# EAGLE design Actuator-MKI-3 (EAGLE 9.6.2)

## Sheet 1 of 2: Part Schematics
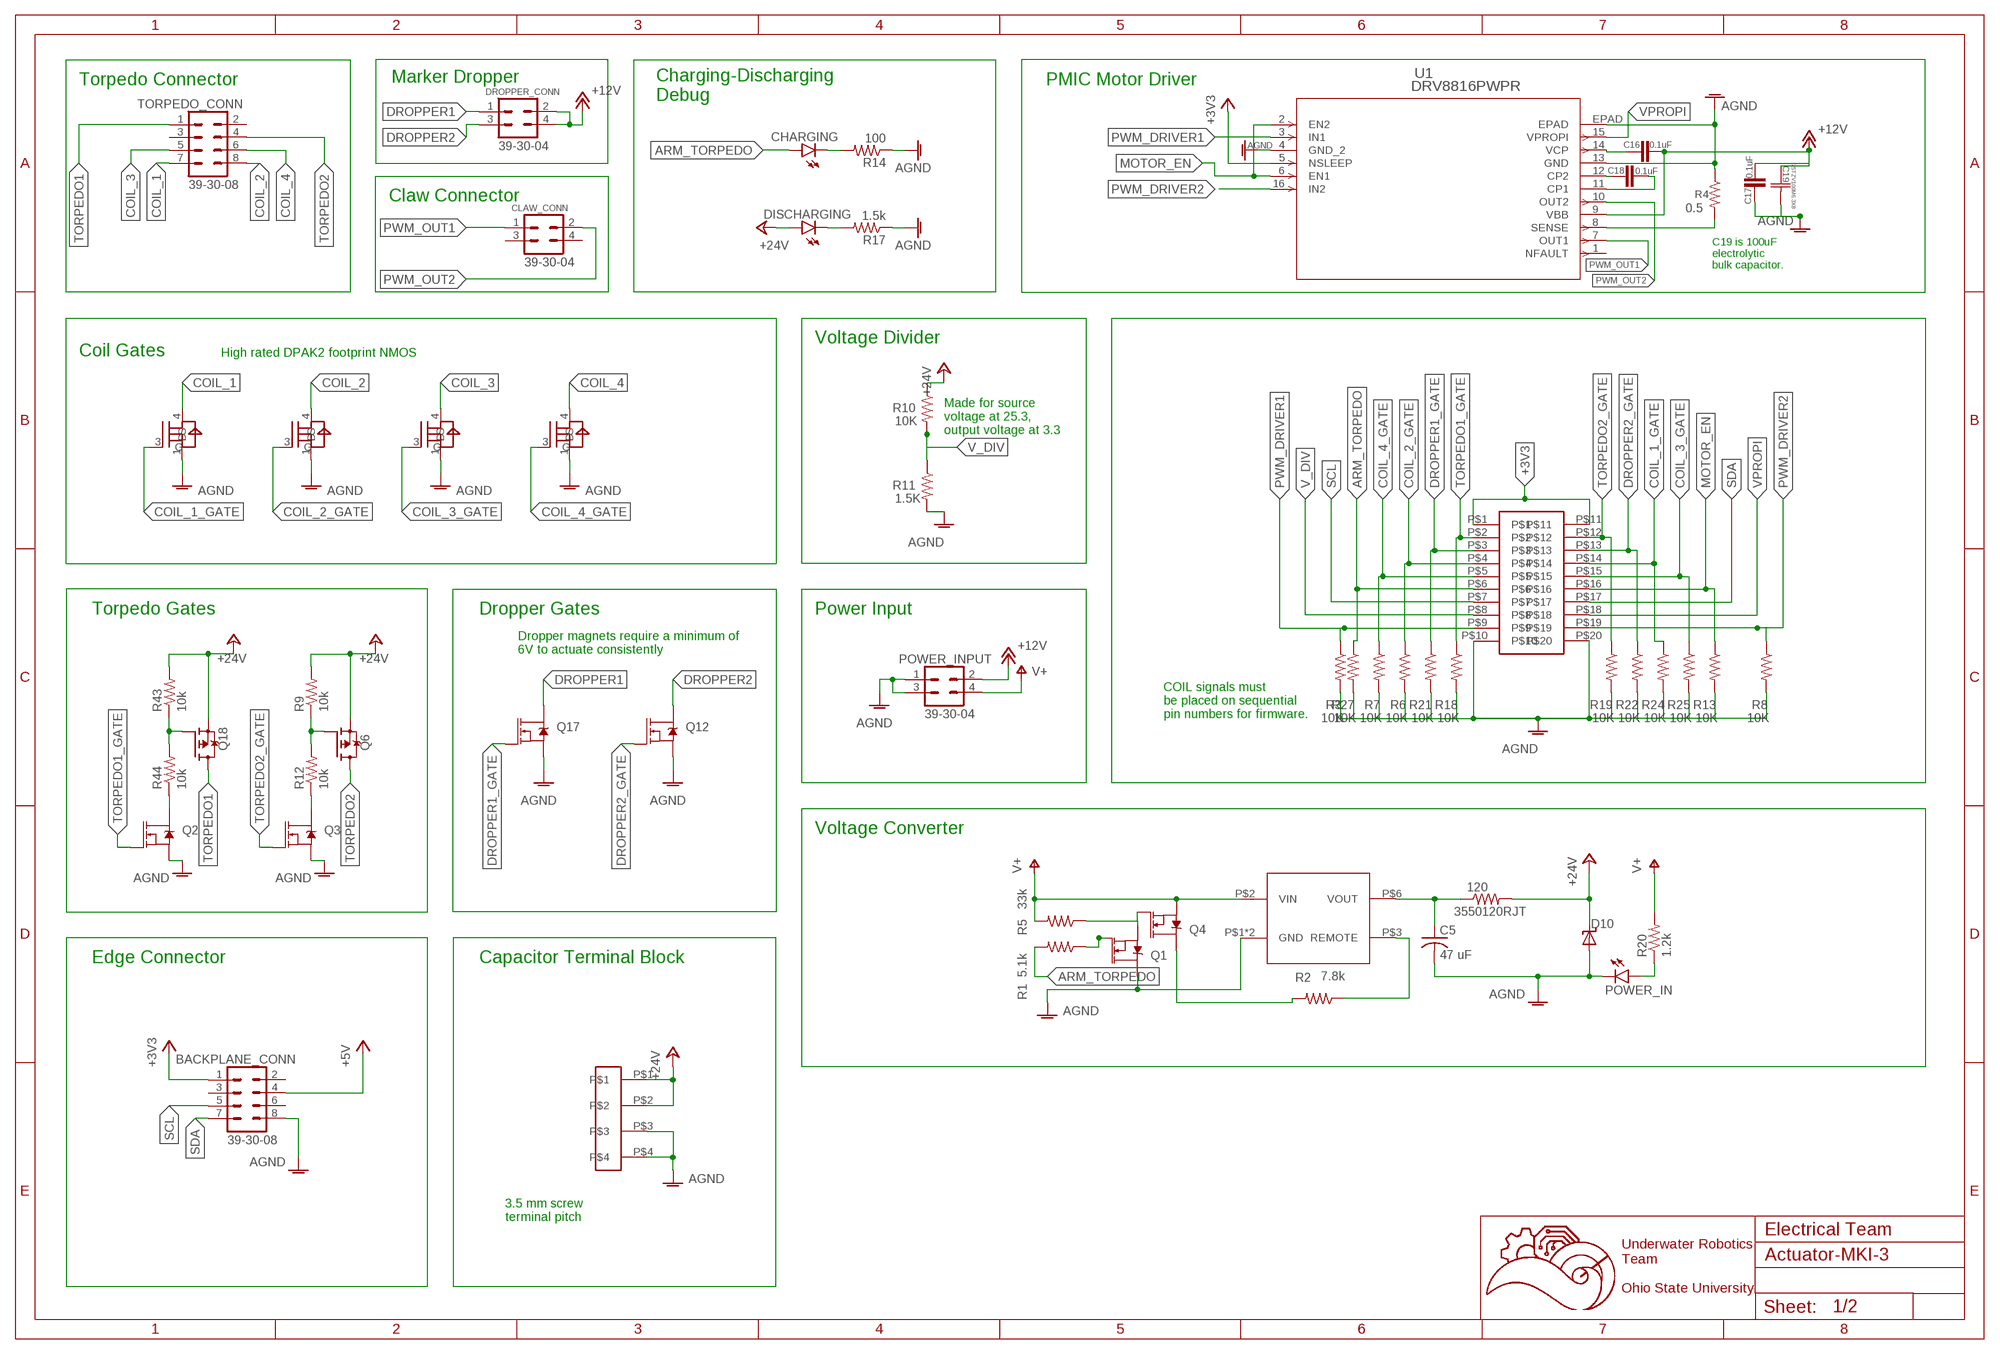
[diagram p0: schematic, sheet 1]

### Parts
120  3550120RJT  [3550120RJT]
BACKPLANE_CONN  39-30-08  [39-30-?08?]
C5  47 uF  C-USC1206K  [C1206K]
C16  0.1uF  C-EUC0603  [C0603]
C17  0.1uF  C-EUC0603  [C0603]
C18  0.1uF  C-EUC0603  [C0603]
C19  25TZV100M6.3X8  [CAP_J-V_6P3X8_RUB]
CHARGING  LEDCHIPLED_0603  [CHIPLED_0603]
CLAW_CONN  39-30-04  [39-30-?04?]
D10  SUPPRESSOR-SMBJ  [SMBJ]
DISCHARGING  LEDCHIPLED_0603  [CHIPLED_0603]
DROPPER_CONN  39-30-04  [39-30-?04?]
POWER_IN  LEDCHIPLED_0603  [CHIPLED_0603]
POWER_INPUT  39-30-04  [39-30-?04?]
Q1  MOSFET-NCH-AO3404A  [SOT23-3]
Q2  MOSFET-NCH-AO3404A  [SOT23-3]
Q3  MOSFET-NCH-AO3404A  [SOT23-3]
Q4  MOSFET-NCH-AO3404A  [SOT23-3]
Q6  FDD4141TO252  [TO252]
Q12  MOSFET-NCH-AO3404A  [SOT23-3]
Q17  MOSFET-NCH-AO3404A  [SOT23-3]
Q18  FDD4141TO252  [TO252]
R1  5.1k  R-US_R0603  [R0603]
R2  7.8k  R-US_R0603  [R0603]
R3  10K  R-US_R0603  [R0603]
R4  0.5  R-US_R0805  [R0805]
R5  33k  R-US_R0603  [R0603]
R6  10K  R-US_R0603  [R0603]
R7  10K  R-US_R0603  [R0603]
R8  10K  R-US_R0603  [R0603]
R9  10k  R-US_R0603  [R0603]
R10  10K  R-US_R0603  [R0603]
R11  1.5K  R-US_R0603  [R0603]
R12  10k  R-US_R0603  [R0603]
R13  10K  R-US_R0603  [R0603]
R14  100  R-US_R0805  [R0805]
R17  1.5k  R-US_R0805  [R0805]
R18  10K  R-US_R0603  [R0603]
R19  10K  R-US_R0603  [R0603]
R20  1.2k  R-US_R0805  [R0805]
R21  10K  R-US_R0603  [R0603]
R22  10K  R-US_R0603  [R0603]
R24  10K  R-US_R0603  [R0603]
R25  10K  R-US_R0603  [R0603]
R27  10K  R-US_R0603  [R0603]
R43  10k  R-US_R0603  [R0603]
R44  10k  R-US_R0603  [R0603]
TORPEDO_CONN  39-30-08  [39-30-?08?]
U1  DRV8816PWPR  [PWP_16]
U2  MBRB2060CTT4G  [D2PAK3-4_9P65X10P29_ONS]
U3  MBRB2060CTT4G  [D2PAK3-4_9P65X10P29_ONS]
U4  MBRB2060CTT4G  [D2PAK3-4_9P65X10P29_ONS]
U5  MBRB2060CTT4G  [D2PAK3-4_9P65X10P29_ONS]
U$1  31059104  [31059104]
U$2  JTAG-SMD  [JTAG-SMD]
U$6  TMR6-2415  [TMR6-2415]

### Nets
+3V3: BACKPLANE_CONN.1 U1.5(NSLEEP) U$2.P$1 U$2.P$11
+5V: BACKPLANE_CONN.4
+12V: C16.2 C17.2 C19.1 DROPPER_CONN.2 DROPPER_CONN.4 POWER_INPUT.2 U1.9(VBB)
+24V: 120.P$2 D10.C DISCHARGING.A Q6.2(S) Q18.2(S) R9.2 R10.1 R43.2 U$1.P$1 U$1.P$2
AGND: BACKPLANE_CONN.8 C5.2 C17.1 C19.2 D10.A POWER_IN.C POWER_INPUT.1 POWER_INPUT.3 Q1.3(D) Q2.2(S) Q3.2(S) Q12.2(S) Q17.2(S) R3.2 R4.1 R6.2 R7.2 R8.2 R11.2 R13.2 R14.1 R17.1 R18.2 R19.2 R21.2 R22.2 R24.2 R25.2 R27.2 U1.4(GND_2) U1.13(GND) U1.EPAD U2.1(S) U3.1(S) U4.1(S) U5.1(S) U$1.P$3 U$1.P$4 U$2.P$10 U$2.P$20 U$6.P$1(GND) U$6.P$7(GND)
ARM_TORPEDO: CHARGING.A R1.2 R27.1 U$2.P$6
COIL_1: TORPEDO_CONN.7 U2.4(D)
COIL_1_GATE: R24.1 U2.3(G) U$2.P$14
COIL_2: TORPEDO_CONN.8 U3.4(D)
COIL_2_GATE: R6.1 U3.3(G) U$2.P$4
COIL_3: TORPEDO_CONN.5 U4.4(D)
COIL_3_GATE: R25.1 U4.3(G) U$2.P$15
COIL_4: TORPEDO_CONN.6 U5.4(D)
COIL_4_GATE: R7.1 U5.3(G) U$2.P$5
DROPPER1: DROPPER_CONN.1 Q17.3(D)
DROPPER1_GATE: Q17.1(G) R21.1 U$2.P$3
DROPPER2: DROPPER_CONN.3 Q12.3(D)
DROPPER2_GATE: Q12.1(G) R22.1 U$2.P$13
MOTOR_EN: R13.1 U1.2(EN2) U1.6(EN1) U$2.P$16
N$2: C16.1 U1.14(VCP)
N$3: R2.1 U$6.P$3(REMOTE)
N$4: CHARGING.C R14.2
N$5: Q1.1(G) R1.1
N$6: Q1.2(S) Q4.1(G) R5.1
N$7: Q4.3(D) R2.2
N$10: POWER_IN.A R20.1
N$15: DISCHARGING.C R17.2
N$26: 120.P$1 C5.1 U$6.P$6(VOUT)
N$33: Q18.1(G) R43.1 R44.2
N$34: Q2.3(D) R44.1
N$35: Q6.1(G) R9.1 R12.2
N$36: Q3.3(D) R12.1
N$45: R4.2 U1.8(SENSE)
N$48: C18.2 U1.11(CP1)
N$49: C18.1 U1.12(CP2)
PWM_DRIVER1: R3.1 U1.3(IN1) U$2.P$9
PWM_DRIVER2: R8.1 U1.16(IN2) U$2.P$19
PWM_OUT1: CLAW_CONN.1 U1.7(OUT1)
PWM_OUT2: CLAW_CONN.2 U1.10(OUT2)
SCL: BACKPLANE_CONN.5 U$2.P$7
SDA: BACKPLANE_CONN.7 U$2.P$17
TORPEDO1: Q18.3(D) TORPEDO_CONN.1
TORPEDO1_GATE: Q2.1(G) R18.1 U$2.P$2
TORPEDO2: Q6.3(D) TORPEDO_CONN.4
TORPEDO2_GATE: Q3.1(G) R19.1 U$2.P$12
V+: POWER_INPUT.4 Q4.2(S) R5.2 R20.2 U$6.P$2(VIN)
V_DIV: R10.2 R11.1 U$2.P$8
VPROPI: U1.15(VPROPI) U$2.P$18
Unconnected: BACKPLANE_CONN.2 BACKPLANE_CONN.3 BACKPLANE_CONN.6 CLAW_CONN.3 CLAW_CONN.4 TORPEDO_CONN.2 TORPEDO_CONN.3 U1.1(NFAULT)

### Notes on the sheet
- Torpedo Connector | Marker Dropper | PMIC Motor Driver
- Charging-Discharging 
  Debug
- Claw Connector
- C19 is 100uF
  electrolytic
  bulk capacitor.
- Voltage Divider
- Coil Gates | High rated DPAK2 footprint NMOS
- Made for source 
  voltage at 25.3, 
  output voltage at 3.3
- Torpedo Gates | Dropper Gates | Power Input
- Dropper magnets require a minimum of 
  6V to actuate consistently
- COIL signals must
  be placed on sequential
  pin numbers for firmware.
- Voltage Converter
- Edge Connector | Capacitor Terminal Block
- 3.5 mm screw 
  terminal pitch
- Electrical Team
- Underwater Robotics
  Team
  
  Ohio State University

## Sheet 2 of 2: Notes
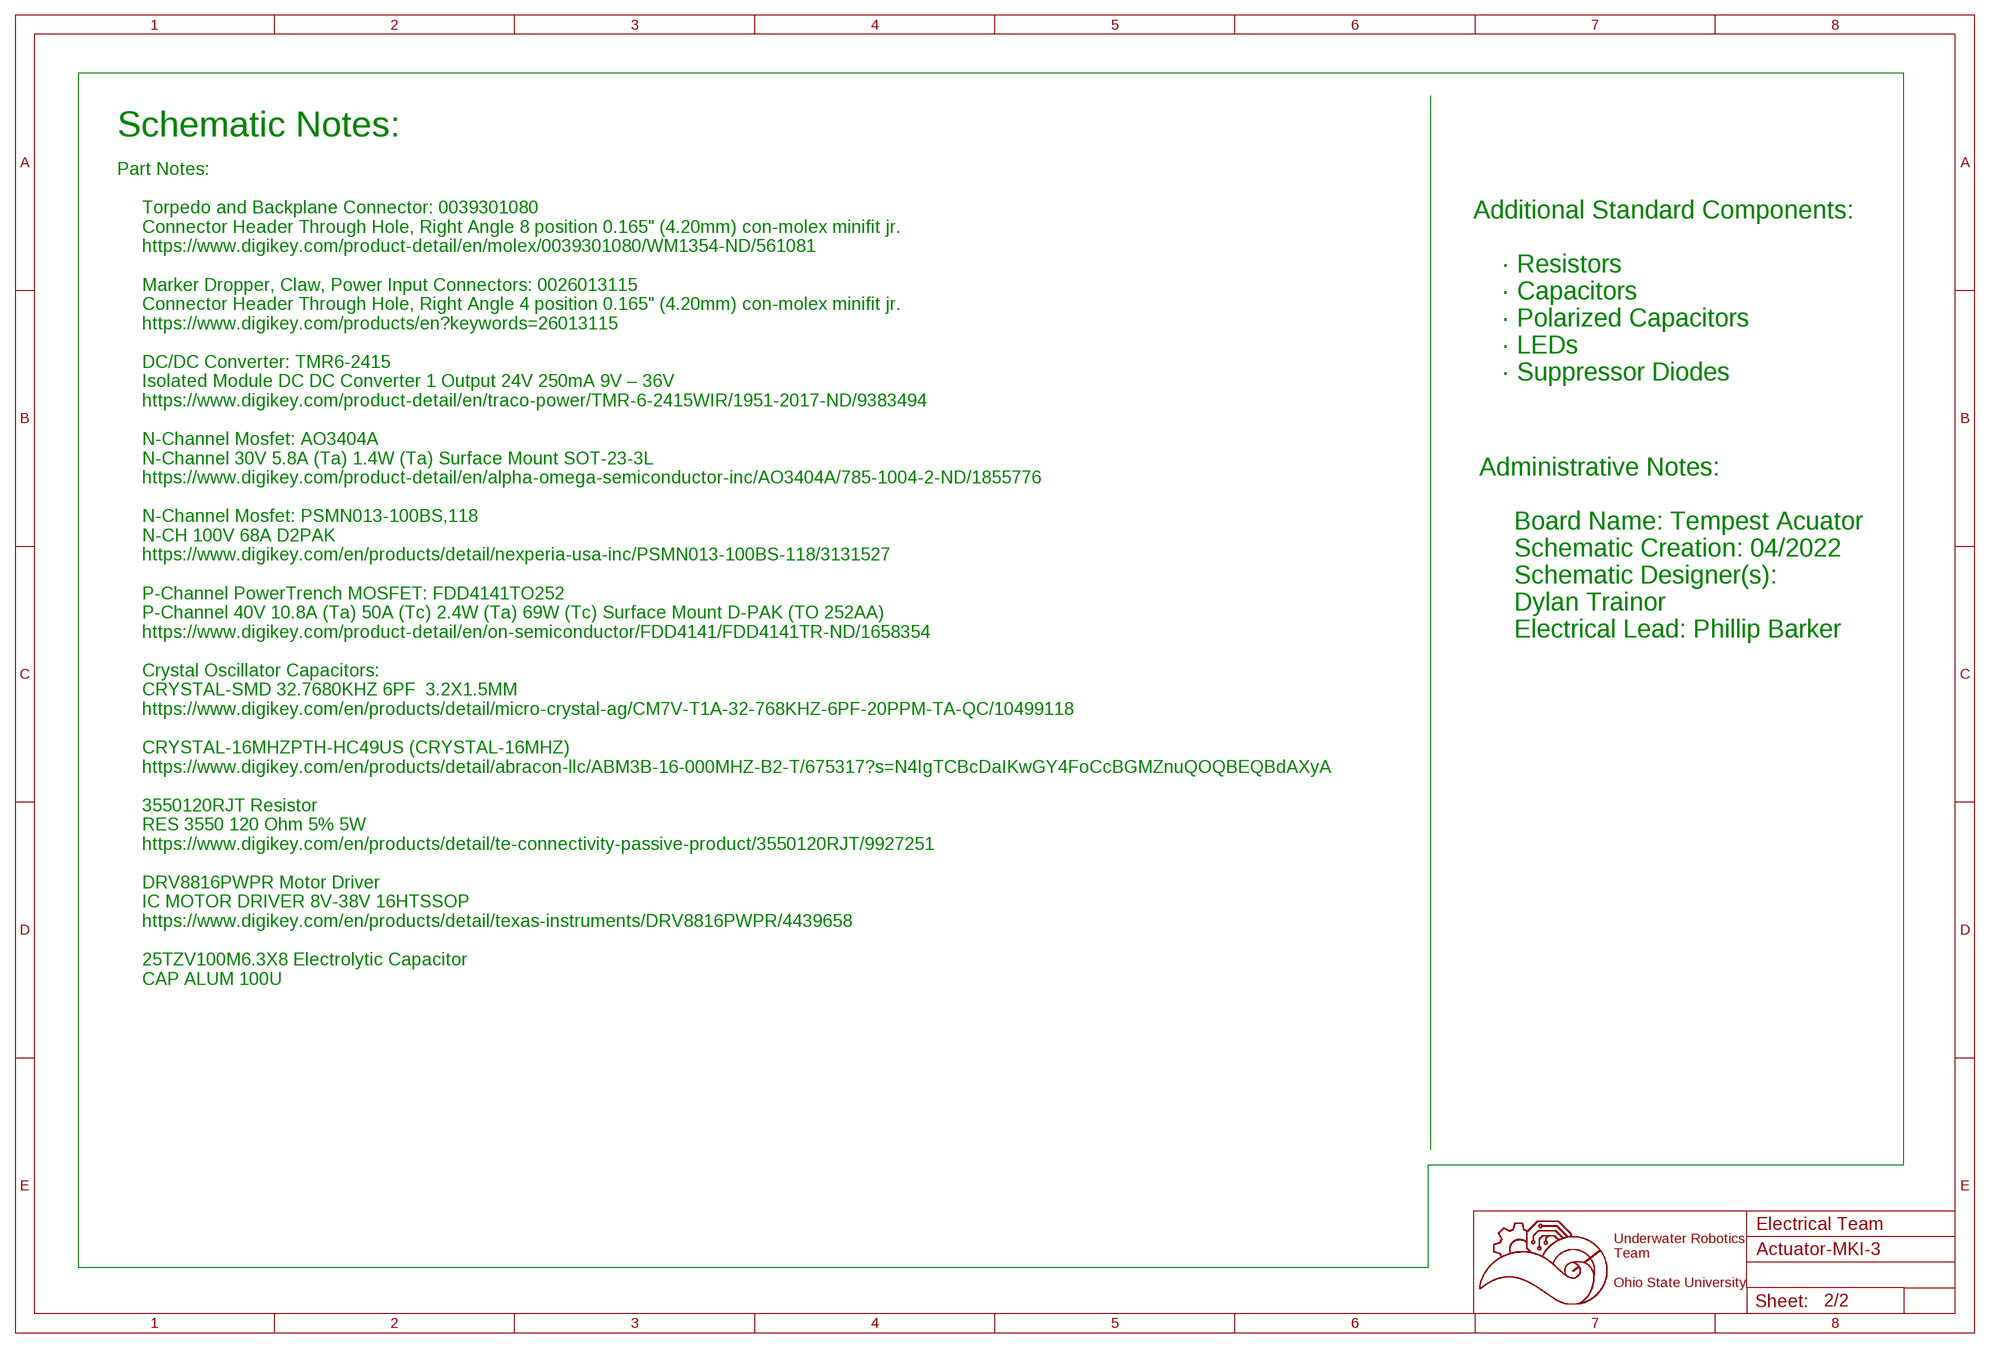
[diagram p1: schematic, sheet 2]

### Notes on the sheet
- Schematic Notes:
- Part Notes:
  
       Torpedo and Backplane Connector: 0039301080 
       Connector Header Through Hole, Right Angle 8 position 0.165" (4.20mm) con-molex minifit jr. 
       https://www.digikey.com/product-detail/en/molex/0039301080/WM1354-ND/561081 
    
       Marker Dropper, Claw, Power Input Connectors: 0026013115 
       Connector Header Through Hole, Right Angle 4 position 0.165" (4.20mm) con-molex minifit jr. 
       https://www.digikey.com/products/en?keywords=26013115 
    
       DC/DC Converter: TMR6-2415 
       Isolated Module DC DC Converter 1 Output 24V 250mA 9V – 36V 
       https://www.digikey.com/product-detail/en/traco-power/TMR-6-2415WIR/1951-2017-ND/9383494 
    
       N-Channel Mosfet: AO3404A 
       N-Channel 30V 5.8A (Ta) 1.4W (Ta) Surface Mount SOT-23-3L 
       https://www.digikey.com/product-detail/en/alpha-omega-semiconductor-inc/AO3404A/785-1004-2-ND/1855776 
    
       N-Channel Mosfet: PSMN013-100BS,118
       N-CH 100V 68A D2PAK
       https://www.digikey.com/en/products/detail/nexperia-usa-inc/PSMN013-100BS-118/3131527
  
       P-Channel PowerTrench MOSFET: FDD4141TO252 
       P-Channel 40V 10.8A (Ta) 50A (Tc) 2.4W (Ta) 69W (Tc) Surface Mount D-PAK (TO 252AA) 
       https://www.digikey.com/product-detail/en/on-semiconductor/FDD4141/FDD4141TR-ND/1658354
  
       Crystal Oscillator Capacitors: 
       CRYSTAL-SMD 32.7680KHZ 6PF  3.2X1.5MM 
       https://www.digikey.com/en/products/detail/micro-crystal-ag/CM7V-T1A-32-768KHZ-6PF-20PPM-TA-QC/10499118
  
       CRYSTAL-16MHZPTH-HC49US (CRYSTAL-16MHZ)
       https://www.digikey.com/en/products/detail/abracon-llc/ABM3B-16-000MHZ-B2-T/675317?s=N4IgTCBcDaIKwGY4FoCcBGMZnuQOQBEQBdAXyA 
  
       3550120RJT Resistor
       RES 3550 120 Ohm 5% 5W
       https://www.digikey.com/en/products/detail/te-connectivity-passive-product/3550120RJT/9927251
  
       DRV8816PWPR Motor Driver
       IC MOTOR DRIVER 8V-38V 16HTSSOP
       https://www.digikey.com/en/products/detail/texas-instruments/DRV8816PWPR/4439658
  
       25TZV100M6.3X8 Electrolytic Capacitor
       CAP ALUM 100UF 20% 25V SMD
       https://www.digikey.com/en/products/detail/rubycon/25TZV100M6-3X8/3134865
  
       UVK1E223MRD 22mF Capacitor
       CAP ALUM 22000UF 20% 25V RADIAL
       https://www.digikey.com/en/products/detail/nichicon/UVK1E223MRD/2539394
  
       1776112-4 Block Terminal
       TERM BLK 4POS SIDE ENT 3.5MM PCB
       https://www.digikey.com/en/products/detail/te-connectivity-amp-connectors/1776112-4/1826838
- Additional Standard Components:
  
       · Resistors 
       · Capacitors 
       · Polarized Capacitors 
       · LEDs 
       · Suppressor Diodes
- Administrative Notes:
  
       Board Name: Tempest Acuator
       Schematic Creation: 04/2022
       Schematic Designer(s): 
       Dylan Trainor
       Electrical Lead: Phillip Barker
- Electrical Team
- Underwater Robotics
  Team
  
  Ohio State University

## Library data of the parts
120 = 3550120RJT:3550120RJT
BACKPLANE_CONN TORPEDO_CONN = con-molex-mini-fit:39-30-?08?: HEADER
C5 = resistor:C-US: CAPACITOR, American symbol
C16-C18 = rcl:C-EU: CAPACITOR, European symbol; SPICEPREFIX: C
C19 = 25TZV100M6_3X8:25TZV100M6.3X8; BUILT_BY: EMA_Cory; COPYRIGHT: Copyright (C) 2018 Accelerated Designs. All rights reserved; MANUFACTURER_PART_NUMBER: 25TZV100M6.3X8; SOURCELIBRARY: Rubycon_2019-09-19; VENDOR: Rubycon Netherlands
CHARGING DISCHARGING POWER_IN = led:LED: LED OSRAM: - CHIPLED LG R971, LG N971, LY N971, LG Q971, LY Q971, LO R971, LY R971 LH N974, LH R974 LS Q976, LO Q976, LY Q976 LO Q996 - Hyper CHIPLED LW Q18S LB Q993, LB Q99A, LB R99A - SideLED LS A670, LO A670, LY A670, LG A670, LP A670 LB A673, LV A673, LT A673, LW A673 LH A674 LY A675 LS A676, LA A676, LO A676, LY A676, LW A676 LS A679, LY A679, LG A679 - Hyper Micro SIDELED® LS Y876, LA Y876, LO Y876, LY Y876 LT Y87S - SmartLED LW L88C, LW L88S LB L89C, LB L89S, LG L890 LS L89K, LO L89K, LY L89K LS L896, LA L896, LO L896, LY L896 - TOPLED LS T670, LO T670, LY T670, LG T670, LP T670 LSG T670, LSP T670, LSY T670, LOP T670, LYG T670 LG T671, LOG T671, LSG T671 LB T673, LV T673, LT T673, LW T673 LH T674 LS T676, LA T676, LO T676, LY T676, LB T676, LH T676, LSB T676, LW T676 LB T67C, LV T67C, LT T67C, LS T67K, LO T67K, LY T67K, LW E67C LS E67B, LA E67B, LO E67B, LY E67B, LB E67C, LV E67C, LT E67C LW T67C LS T679, LY T679, LG T679 LS T770, LO T770, LY T770, LG T770, LP T770 LB T773, LV T773, LT T773, LW T773 LH T774 LS E675, LA E675, LY E675, LS T675 LS T776, LA T776, LO T776, LY T776, LB T776 LHGB T686 LT T68C, LB T68C - Hyper Mini TOPLED® LB M676 - Mini TOPLED Santana® LG M470 LS M47K, LO M47K, LY M47K Source: http://www.osram.convergy.de LUXEON: - LUMILED® LXK2-PW12-R00, LXK2-PW12-S00, LXK2-PW14-U00, LXK2-PW14-V00 LXK2-PM12-R00, LXK2-PM12-S00, LXK2-PM14-U00 LXK2-PE12-Q00, LXK2-PE12-R00, LXK2-PE12-S00, LXK2-PE14-T00, LXK2-PE14-U00 LXK2-PB12-K00, LXK2-PB12-L00, LXK2-PB12-M00, LXK2-PB14-N00, LXK2-PB14-P00, LXK2-PB14-Q00 LXK2-PR12-L00, LXK2-PR12-M00, LXK2-PR14-Q00, LXK2-PR14-R00 LXK2-PD12-Q00, LXK2-PD12-R00, LXK2-PD12-S00 LXK2-PH12-R00, LXK2-PH12-S00 LXK2-PL12-P00, LXK2-PL12-Q00, LXK2-PL12-R00 Source: www.luxeon.com KINGBRIGHT: KA-3528ASYC Source: www.kingbright.com
CLAW_CONN DROPPER_CONN POWER_INPUT = con-molex-mini-fit:39-30-?04?: HEADER
D10 = diode:SUPPRESSOR-: Suppressor diode
Q1-Q4 Q12 Q17 = SparkFun-DiscreteSemi:MOSFET-NCH: N-channel MOSFETs Voltage controlled devices that allow control of high current outputs. SparkFun Products: SparkFun OpenScale <https://www.sparkfun.com/products/13261> SparkFun Digital Sandbox <https://www.sparkfun.com/products/12651> SparkFun Monster Moto Shield <https://www.sparkfun.com/products/10182> SparkFun MOSFET Power Controller <https://www.sparkfun.com/products/11214>; PROD_ID: TRANS-12988; VALUE: 5.8A/30V/35mΩ
Q6 Q18 = transistor-fet:FDD4141: P-Channel PowerTrench® MOSFET Source: FDD4141.pdf
R1-R14 R17-R22 R24 R25 R27 R43 R44 = resistor:R-US_: RESISTOR, American symbol
U1 = DRV8816POWPR:DRV8816PWPR; MANUFACTURER_PART_NUMBER: DRV8816PWPR; VENDOR: Texas Instruments
U2-U5 = DPAK2:MBRB2060CTT4G
U$1 = 31059104:31059104
U$2 = JTAG-SMD:JTAG-SMD
U$6 = converter:TMR6-2415

## Board
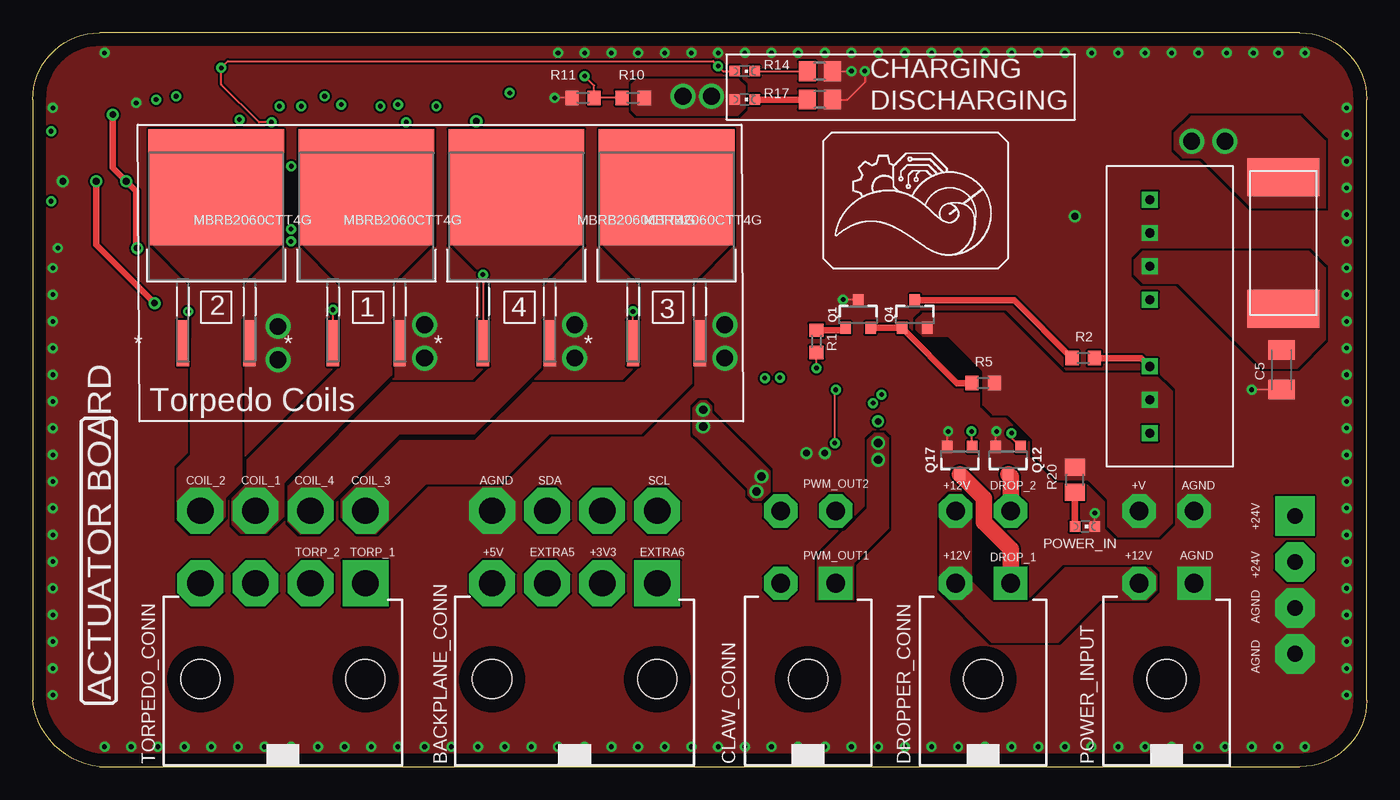
[diagram p2: board, top side]
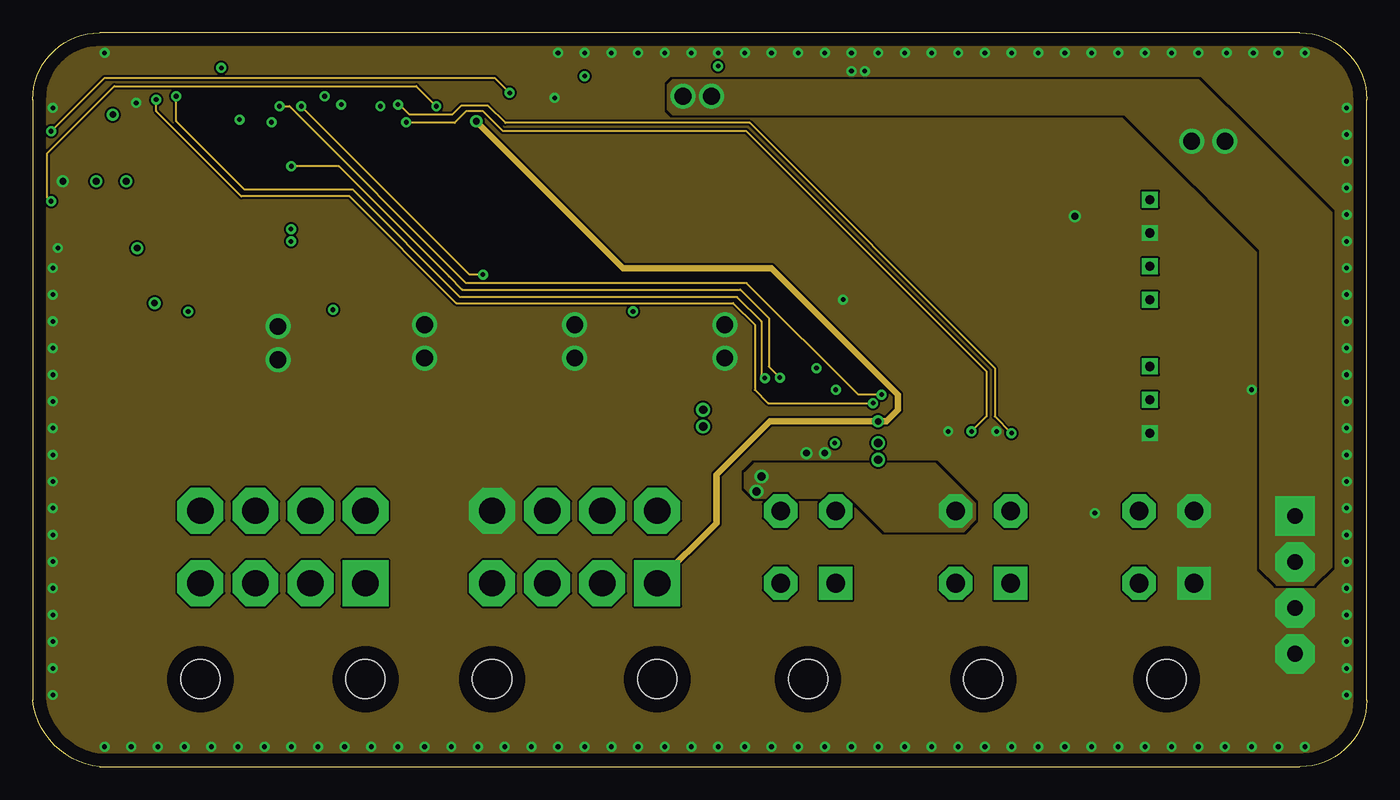
[diagram p3: board, inner layer Route2]
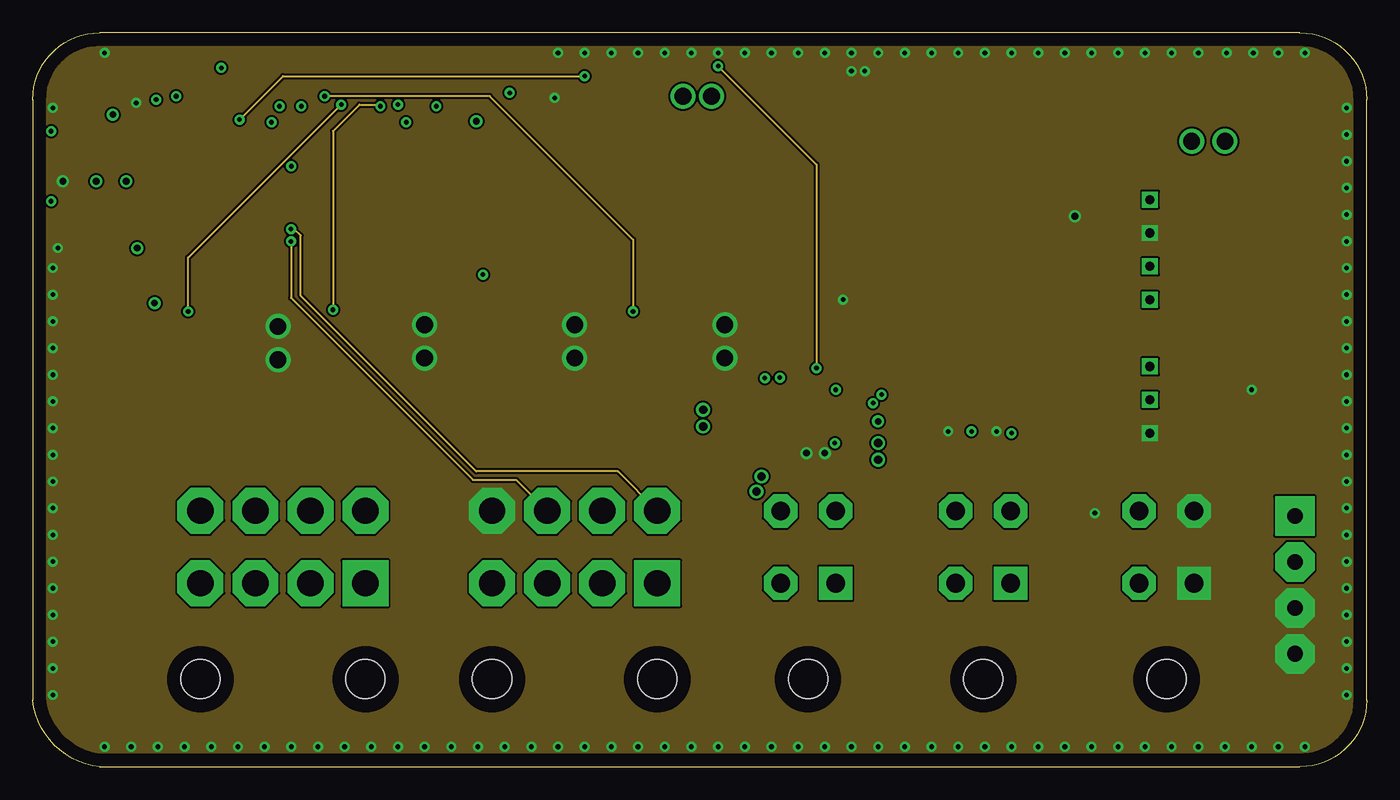
[diagram p4: board, inner layer Route15]
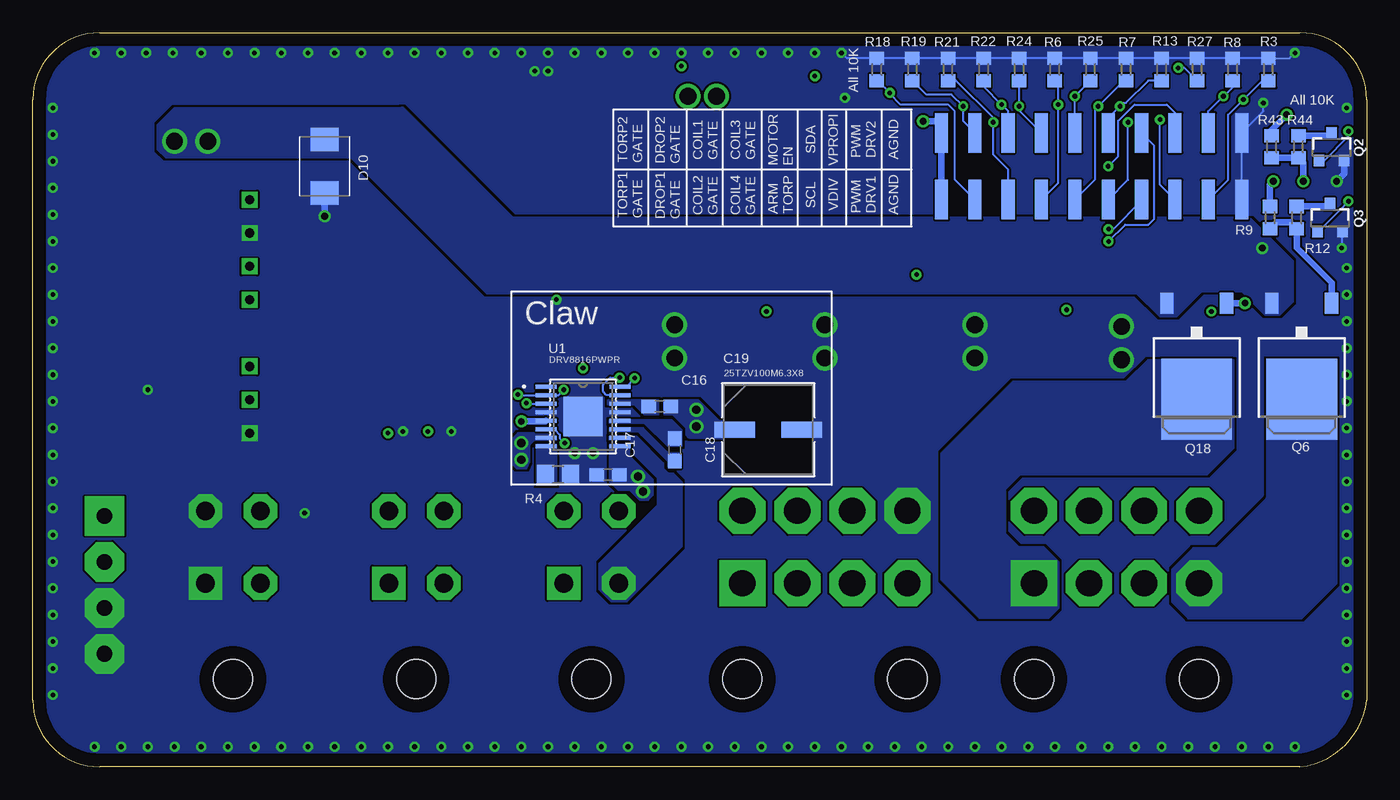
[diagram p5: board, bottom side, seen from below]

Size 101.6 x 55.88 mm. Coordinates in mm from the lower left corner, seen from the top.
Outline: 5.08,0 96.52,0 arc90 101.6,5.08 101.6,50.8 arc90 96.52,55.88 5.08,55.88 arc90 0,50.8 0,5.08 arc77 5.08,0
Copper layers (1+2*15+16): Top 0.035mm / dielectric 1.5mm / Route2 0.035mm / dielectric 0.15mm / Route15 0.035mm / dielectric 0.2mm / Bottom 0.035mm
Design rules "default *": minimum track width 6mil, minimum drill 0.35mm, track to track 6mil, track to pad 6mil, pad to pad 6mil, via to via 6mil, smd to smd 6mil, copper to edge 40mil, drill to drill 6mil, minimum pad ring 10mil, minimum via ring 8mil, stop-mask expansion 4mil, vias tented up to drill 0mil, thermal gap 10mil

### Footprints (pad centres in the part's own frame; a part is rotated, then mirrored left to right if it is on the bottom)
3550120RJT = smd 2.896 x 5.499: P$1 -5,0; P$2 5,0
39-30-?08? = drill 2 pad 3.5 square: 1 6.287,0 | drill 2 pad 3.5 octagon: 2 2.095,0; 3 -2.095,0; 4 -6.287,0; 5 6.287,5.512; 6 2.095,5.512; 7 -2.095,5.512; 8 -6.287,5.512 | hole 3: -6.287,-7.3; 6.287,-7.3
C1206K = smd 1.5 x 2: 1 -1.5,0; 2 1.5,0
C0603 = smd 1.1 x 1: 1 -0.85,0; 2 0.85,0
CAP_J-V_6P3X8_RUB = smd 3.099 x 1.219: 1 -2.553,0; 2 2.553,0
CHIPLED_0603 = smd 0.8 x 0.8: A 0,-0.75; C 0,0.75
39-30-?04? = drill 1.422 pad 2.54 square: 1 2.095,0 | drill 1.422 pad 2.54 octagon: 2 -2.095,0; 3 2.095,5.512; 4 -2.095,5.512 | hole 3: 0,-7.3
SMBJ = smd 1.78 x 2.16: A 2.04,0; C -2.03,0
SOT23-3 = smd 0.8 x 0.9: 1 -0.95,-1; 2 0.95,-1; 3 0,1.1
TO252 = smd 1 x 1.6: 1 -2.28,-4.8; 2 2.28,-4.8 | smd 5.4 x 6.2: 3 0,2.5
R0603 = smd 1 x 1.1: 1 -0.85,0; 2 0.85,0
R0805 = smd 1.3 x 1.5: 1 -0.95,0; 2 0.95,0
PWP_16 = smd 1.6 x 0.3: 1 -2.8,2.275; 2 -2.8,1.625; 3 -2.8,0.975; 4 -2.8,0.325; 5 -2.8,-0.325; 6 -2.8,-0.975; 7 -2.8,-1.625; 8 -2.8,-2.275; 9 2.8,-2.275; 10 2.8,-1.625; 11 2.8,-0.975; 12 2.8,-0.325; 13 2.8,0.325; 14 2.8,0.975; 15 2.8,1.625; 16 2.8,2.275 | smd 3 x 3: EPAD 0,0
D2PAK3-4_9P65X10P29_ONS = smd 0.94 x 3.505: 1 2.54,-9.652; 3 -2.54,-9.652 | smd 10.338 x 8.839: 4 0,2.21
31059104 = drill 1.2 pad 3 square: P$1 0,-5.25 | drill 1.2 pad 3 octagon: P$2 0,-1.75; P$3 0,1.75; P$4 0,5.25
JTAG-SMD = smd 3 x 1: P$1 -2.54,11.43; P$2 -2.54,8.89; P$3 -2.54,6.35; P$4 -2.54,3.81; P$5 -2.54,1.27; P$6 -2.54,-1.27; P$7 -2.54,-3.81; P$8 -2.54,-6.35; P$9 -2.54,-8.89; P$10 -2.54,-11.43; P$11 2.54,11.43; P$12 2.54,8.89; P$13 2.54,6.35; P$14 2.54,3.81; P$15 2.54,1.27; P$16 2.54,-1.27; P$17 2.54,-3.81; P$18 2.54,-6.35; P$19 2.54,-8.89; P$20 2.54,-11.43
TMR6-2415 = drill 0.7 square: P$1 0,0; P$2 2.54,0; P$3 5.08,0; P$5 10.16,0; P$6 12.7,0; P$7 15.24,0; P$8 17.78,0

### Placement (x,y rotation side)
120  95.25,39.88 90 top
BACKPLANE_CONN  39-30-08?  [39-30-?08?]  41.27,13.97 0 top
C5  95.12,30.23 270 top
C16  53.85,27.43 0 bottom
C17  57.78,22.23 0 bottom
C18  52.7,24.13 270 bottom
C19  45.59,25.65 0 bottom
CHARGING  54.23,52.96 270 top
CLAW_CONN  39-30-04?  [39-30-?04?]  59.05,13.97 0 top
D10  79.38,45.72 270 bottom
DISCHARGING  54.23,50.8 270 top
DROPPER_CONN  39-30-04?  [39-30-?04?]  72.39,13.97 0 top
POWER_IN  80.14,18.29 270 top
POWER_INPUT  39-30-04?  [39-30-?04?]  86.36,13.97 0 top
Q1  62.87,34.42 0 top
Q2  2.67,47.16 0 bottom
Q3  2.79,41.76 0 bottom
Q4  67.18,34.42 0 top
Q6  4.95,30.48 180 bottom
Q12  74.3,23.37 180 top
Q17  70.61,23.37 180 top
Q18  12.95,30.48 180 bottom
R1  59.69,32.38 270 top
R2  80.01,31.11 180 top
R3  7.49,53.09 90 bottom
R4  61.59,22.23 180 bottom
R5  72.39,29.21 0 top
R6  23.76,53.09 90 bottom
R7  18.34,53.09 90 bottom
R8  10.2,53.09 90 bottom
R9  7.37,41.81 90 bottom
R10  45.72,50.93 180 top
R11  41.91,50.93 180 top
R12  5.33,41.81 270 bottom
R13  15.63,53.09 90 bottom
R14  59.94,52.96 180 top
R17  59.94,50.8 180 top
R18  37.31,53.09 90 bottom
R19  34.6,53.09 90 bottom
R20  79.38,21.84 90 top
R21  31.89,53.09 90 bottom
R22  29.18,53.09 90 bottom
R24  26.47,53.09 90 bottom
R25  21.05,53.09 90 bottom
R27  12.92,53.09 90 bottom
R43  7.24,47.21 90 bottom
R44  5.21,47.21 270 bottom
TORPEDO_CONN  39-30-08?  [39-30-?08?]  19.05,13.97 0 top
U1  59.69,26.67 0 bottom
U2  25.4,41.91 0 top
U3  13.97,41.91 0 top
U4  48.26,41.91 0 top
U5  36.83,41.91 0 top
U$1  96.14,13.84 180 top
U$2  20.95,45.72 90 bottom
U$6  85.09,25.4 90 top

### Tracks (layer width: path | path; a pad name or v marks a point on that pad's centre or on a via)
+3V3  (via drill 0.51)
  Route2 0.508: v33.78,49.15 44.96,37.97 56.26,37.97 65.91,28.32 65.91,27.18 65.02,26.29 v64.39,26.29 56.13,26.29 52.07,22.23 52.07,18.54 47.56,14.03 BACKPLANE_CONN.1
  Bottom 0.508: v64.39,26.29 62.55,26.29 U1.5 | v33.78,49.15 32.64,49.15 32.38,48.9 U$2.P$11 U$2.P$1
+12V  (via drill 0.64)
  other vias: 55.5,22.1 55.12,20.95 51.05,25.91 51.05,27.18
  pour Bottom (no thermals): 57.66,24.51 57.66,21.72 57.02,21.08 56.13,21.08 55.37,20.32 54.74,20.32 54.36,20.7 54.36,21.84 56.13,23.62 56.13,24.38 56.26,24.51
  pour Bottom (no thermals): 53.47,27.94 50.93,27.94 49.4,26.42 49.4,25.02 51.56,25.02 51.82,25.27 51.82,25.78 52.83,26.8 53.47,26.8
  pour Top (no thermals): 50.55,25.15 54.48,21.21 54.48,20.7 54.86,20.32 55.5,20.32 56.13,20.95 56.13,22.48 51.69,26.92 51.69,27.43 51.31,27.81 50.8,27.81 50.29,27.3 50.29,25.4
  pour Bottom (no thermals): 49.78,25.02 46.61,25.02 46.61,26.29 49.78,26.29
  pour Top (no thermals): 85.09,15.11 78.61,15.11 76.07,12.57 73.03,12.57 71.5,14.1 71.5,19.94 70.74,20.7 69.85,20.7 69.09,19.94 69.09,13.46 73.03,9.53 78.11,9.53 81.28,12.7 84.84,12.7 85.6,13.46 85.6,14.61
  pour Route2 (no thermals): 54.23,21.21 54.23,22.35 54.99,23.11 68.71,23.11 71.75,20.07 71.75,18.8 70.87,17.91 64.9,17.91 62.36,20.45 54.99,20.45
+24V  (via drill 0.51, 1.27)
  Top 0.508: v6.1,49.66 6.1,45.59 v7.11,44.58 7.89,43.8 7.89,39.5 7.93,39.46 v7.95,39.48
  Bottom 0.508: R43.2 7.24,48.51 v6.1,49.66 | R9.2 7.37,44.32 v7.11,44.58
  other vias: 88.27,47.62 90.81,47.62 49.53,51.05 51.69,51.05
  pour Top (no thermals): 92.84,42.55 89.03,46.35 87.63,46.35 87,46.99 87,48.26 88.27,49.53 96.52,49.53 98.42,47.62 98.42,42.55
  pour Bottom (no thermals): 92.08,48.9 90.81,50.16 73.41,50.16 77.22,46.35 91.44,46.35 92.08,46.99
  pour Bottom (no thermals): 77.34,46.35 67.06,36.07 17.53,36.07 15.75,34.29 14.48,34.29 12.57,36.2 9.53,36.2 7.75,34.42 6.6,34.42 5.59,35.43 5.59,38.48 8.89,41.78 65.02,41.78 73.41,50.16 73.53,50.16
  pour Top (no thermals): 54.23,50.16 54.23,51.82 53.72,52.32 45.97,52.32 45.59,51.94 45.59,50.04 45.97,49.66 53.72,49.66
  pour Route2 (no thermals): 48.39,51.94 48.77,52.32 88.77,52.32 92.2,48.9 92.2,45.59 90.93,44.32 88.52,44.32 83.19,49.66 48.77,49.66 48.39,50.04
  pour Route2 (no thermals): 85.6,47.24 93.47,39.37 93.47,15.11 94.74,13.84 97.54,13.84 98.93,15.24 98.93,42.16 90.93,50.16 87.12,50.16 85.6,48.64
AGND  (via drill 0.35, 0.35 pad 0.51, 0.51, 0.51 pad 0.51, 1.27)
  Top 0.152: Q17.2 69.66,25.47 v69.72,25.53 | Q12.2 73.34,25.47 v73.41,25.53 | POWER_IN.C 80.89,19.29 v80.9,19.3 | C5.2 95.1,28.7 v92.84,28.7 | R14.1 v62.36,52.96 | R17.1 62.04,50.8 63.37,52.14 v63.37,52.96 | R11.2 v39.75,50.93 | Q1.3 62.82,35.56 v61.72,35.56
  Bottom 0.152: v5.46,54.36 5.88,53.94 R3.2 R8.2 R27.2 R13.2 R7.2 R25.2 R6.2 R24.2 R22.2 R21.2 R19.2 R18.2 39.59,53.94 v40.01,54.36 | U$2.P$10 U$2.P$20 7.87,49.91 v7.87,50.55 | Q3.2 1.91,40.7 v1.91,39.5
  Bottom 0.508: Q2.2 1.72,45.15 v2.29,44.58 | D10.A v79.38,41.91
  other vias: 29.84,31.11 29.84,33.66 41.27,31.11 41.27,33.66 52.7,33.66 52.7,31.11 18.67,30.99 18.67,33.53 5.46,1.52 7.49,1.52 9.53,1.52 11.56,1.52 13.59,1.52 15.62,1.52 17.65,1.52 19.68,1.52 21.72,1.52 23.75,1.52 25.78,1.52 27.81,1.52 29.84,1.52 31.88,1.52 33.91,1.52 35.94,1.52 37.97,1.52 40.01,1.52 42.04,1.52 44.07,1.52 46.1,1.52 48.13,1.52 50.16,1.52 52.2,1.52 54.23,1.52 56.26,1.52 58.29,1.52 60.33,1.52 62.36,1.52 64.39,1.52 66.42,1.52 68.45,1.52 70.48,1.52 72.52,1.52 74.55,1.52 76.58,1.52 78.61,1.52 80.64,1.52 82.68,1.52 84.71,1.52 86.74,1.52 88.77,1.52 90.81,1.52 92.84,1.52 94.87,1.52 96.9,1.52 42.04,54.36 44.07,54.36 46.1,54.36 48.13,54.36 50.16,54.36 52.2,54.36 54.23,54.36 56.26,54.36 58.29,54.36 60.33,54.36 62.36,54.36 64.39,54.36 66.42,54.36 68.45,54.36 70.48,54.36 72.52,54.36 74.55,54.36 76.58,54.36 78.61,54.36 80.64,54.36 82.68,54.36 84.71,54.36 86.74,54.36 96.9,54.36 1.52,5.46 100.08,5.46 100.08,7.49 100.08,9.53 100.08,11.56 100.08,13.59 100.08,15.62 100.08,17.65 100.08,19.68 100.08,21.72 100.08,23.75 100.08,25.78 100.08,27.81 100.08,29.84 100.08,31.88 100.08,33.91 100.08,35.94 100.08,37.97 100.08,40.01 100.08,42.04 100.08,44.07 100.08,46.1 100.08,48.13 100.08,50.16 1.52,7.49 1.52,9.53 1.52,11.56 1.52,13.59 1.52,15.62 1.52,17.65 1.52,19.68 1.52,21.72 1.52,23.75 1.52,25.78 1.52,27.81 1.52,29.84 1.52,31.88 1.52,33.91 1.52,35.94 1.52,37.97 1.52,50.16 58.93,23.88 60.33,23.88 88.77,54.36 90.93,54.36 92.96,54.36 94.87,54.36
  pour Bottom (no thermals): 58.04,20.95 58.04,26.8 55.88,26.8 55.88,27.18 58.17,27.18 58.17,29.84 61.21,29.84 61.21,27.18 63.5,27.18 63.5,26.8 61.34,26.8 61.34,20.95
  pour Top (rank 6, no thermals): 0,0 101.6,0 101.6,55.88 0,55.88
  pour Route2 (rank 6, no thermals): 0,0 0,55.88 101.6,55.88 101.6,0
  pour Route15 (rank 6, no thermals): 0,0 0,55.88 101.6,55.88 101.6,0
  pour Bottom (rank 6, no thermals): 0,0 0,55.88 101.6,55.88 101.6,0
ARM_TORPEDO  (via drill 0.35)
  Top 0.152: v59.69,30.35 R1.2 | CHARGING.A 52.58,52.96 v52.2,53.34 51.82,53.72 14.86,53.72 v14.35,53.21 14.35,51.94 17.22,49.07 v18.18,49.07
  Route15 0.152: v52.2,53.34 59.69,45.85 v59.69,30.35
  Bottom 0.152: v14.35,53.21 13.89,53.21 R27.1 | U$2.P$6 18.18,44.69 v18.18,49.07
COIL_1
  pour Top (no thermals): 20.32,48.26 30.48,48.26 30.48,40.01 27.3,36.83 27.3,29.84 19.05,21.59 19.05,19.05 17.78,17.78 15.88,17.78 15.24,18.41 15.24,20.45 16.38,21.59 16.38,23.37 23.5,30.48 23.5,36.83 20.32,40.01
COIL_1_GATE  (via drill 0.35)
  Top 0.152: U2.3 v22.86,34.8
  Route15 0.152: v22.86,34.8 22.86,48.39 24.89,50.42 26.34,50.42 v26.47,50.29
  Bottom 0.152: U$2.P$14 26.47,49.97 v26.47,50.29 R24.1
COIL_2
  pour Top (no thermals): 12.06,17.78 11.05,18.8 11.05,22.73 12.06,23.75 12.06,36.83 8.89,40.01 8.89,48.26 19.05,48.26 19.05,40.01 15.88,36.83 15.88,21.72 14.61,20.45 14.61,19.05 13.34,17.78
COIL_2_GATE  (via drill 0.35)
  Top 0.152: v11.83,34.66 11.83,32.66 U3.3
  Route15 0.152: v11.83,34.66 11.83,38.76 v23.5,50.42
  Bottom 0.152: U$2.P$4 23.5,44.45 v23.5,50.42 23.5,51.97 R6.1
COIL_3
  pour Top (no thermals): 43.18,48.26 43.18,40.01 46.35,36.83 46.35,30.48 45.09,29.21 38.1,29.21 33.66,24.77 27.94,24.77 23.5,20.32 23.5,19.05 24.77,17.78 26.16,17.78 29.97,21.59 35.56,21.59 39.37,25.4 46.35,25.4 50.16,29.21 50.16,36.83 53.34,40.01 53.34,48.26
COIL_3_GATE  (via drill 0.35)
  Top 0.152: U4.3 v45.72,34.67
  Route15 0.152: v45.72,34.67 45.72,40.13 34.8,51.05 v22.23,51.05 22.22,51.05
  Bottom 0.152: U$2.P$15 v22.23,51.05 R25.1
COIL_4
  pour Top (no thermals): 31.75,48.26 31.75,40.01 34.92,36.83 34.92,30.48 33.66,29.21 27.3,29.21 19.43,21.34 19.43,18.67 20.32,17.78 21.72,17.78 22.86,18.92 22.86,20.32 27.94,25.4 33.66,25.4 38.73,30.48 38.73,36.83 41.91,40.01 41.91,48.26
COIL_4_GATE  (via drill 0.35)
  Top 0.152: v34.29,37.47 U5.3
  Route2 0.152: v34.29,37.47 33.27,37.47 v20.45,50.29
  Bottom 0.152: R7.1 18.5,52.24 v20.45,50.29 20.7,50.04 20.7,44.7 U$2.P$5
DROPPER1
  Top 1.27: Q17.3 72.43,20.45 72.43,18.63 74.49,16.57 DROPPER_CONN.1
DROPPER1_GATE  (via drill 0.35)
  Top 0.152: v71.5,25.53 71.5,24.43 Q17.1
  Route2 0.152: v71.5,25.53 72.64,26.67 72.64,30.1 54.36,48.39 35.81,48.39 34.29,49.91 33.02,49.91 32.13,49.02 28.5,49.02 v28.45,49.07
  Bottom 0.152: U$2.P$3 27.3,45.47 28.45,46.61 v28.45,49.07 28.45,49.4 31.28,52.24 R21.1
DROPPER2
  Top 1.27: Q12.3 74.49,22.08 DROPPER_CONN.3
DROPPER2_GATE  (via drill 0.35)
  Top 0.152: Q12.1 74.55,25.06 v74.55,25.4
  Route2 0.152: v74.55,25.4 73.28,26.67 73.28,30.35 54.61,49.02 35.99,49.02 34.67,50.34 32.64,50.34 31.95,49.66 28.7,49.66 27.94,50.42 v27.81,50.42
  Bottom 0.152: R22.1 29.18,51.78 | 29.48,51.98 29.48,52.07 29.18,51.78 | U$2.P$13 27.3,49.91 v27.81,50.42 29.17,51.78 29.18,51.78
MOTOR_EN  (via drill 0.35)
  Top 0.152: v61.09,24.64 61.09,28.63 v61.16,28.7
  Route2 0.152: v64.65,28.33 62.87,28.33 54.37,36.83 33.02,36.83 19.56,50.29 v18.8,50.29
  Bottom 0.152: v64.65,28.33 64.62,28.3 U1.2 61.56,28.3 v61.16,28.7 | v61.09,24.64 61.46,25.01 61.46,25.29 61.87,25.7 U1.6 | U$2.P$16 19.68,49.4 v18.8,50.29 18.54,50.55 18.32,50.55 16.64,52.24 R13.1
N$2
  pour Bottom (no thermals): 55.75,27.56 57.78,27.56 57.78,27.94 53.98,27.94 53.98,26.8 54.99,26.8
N$3
  Top 0.508: U$6.P$3 84.45,31.11 R2.1
N$4
  Top 0.152: CHARGING.C R14.2
N$5
  Top 0.508: R1.1 61.73,33.23 Q1.1
N$6
  Top 0.508: Q1.2 Q4.1 66.23,33.37 70.4,29.21 R5.1
N$7
  Top 0.508: R2.2 74.76,35.52 Q4.3
N$10
  Top 0.508: R20.1 POWER_IN.A
N$15
  Top 0.508: DISCHARGING.C R17.2
N$26
  pour Top (no thermals): 83.95,37.47 83.95,38.61 84.58,39.24 97.16,39.24 98.42,37.97 98.42,32.51 96.27,30.35 93.73,30.35 87.25,36.83 84.58,36.83
N$33  (via drill 0.51)
  Top 0.508: v9.27,35.31 4.83,39.75 v4.83,44.58
  Bottom 0.508: R43.1 R44.2 4.83,45.98 v4.83,44.58 | 10.7,35.31 Q18.1 9.3,35.28 v9.27,35.31
N$34
  Bottom 0.508: R44.1 2.87,48.06 Q2.3
N$35
  Bottom 0.508: R9.1 6.86,41.47 5.84,41.47 R12.2 5.33,39.5 2.67,36.84 Q6.1
N$36
  Bottom 0.508: R12.1 2.99,42.66 Q3.3
N$45
  pour Bottom (no thermals): 61.72,21.46 61.72,24.51 63.25,24.51 63.25,21.46
N$48
  pour Bottom (no thermals): 52.32,23.88 53.21,23.88 55.12,25.78 57.66,25.78 57.66,25.53 56.13,25.53 55.5,25.53 55.24,25.27 53.21,23.24 53.21,22.86 52.32,22.86
N$49
  pour Bottom (no thermals): 57.66,26.42 52.96,26.42 52.2,25.65 52.2,24.38 53.21,24.38 54.99,26.16 57.66,26.16
PWM_DRIVER1  (via drill 0.35)
  Route2 0.152: v64.01,27.69 56.01,27.69 54.99,28.7 54.99,33.66 53.34,35.31 32.26,35.31 24.13,43.43 15.88,43.43 9.4,49.91 v9.4,50.8
  Bottom 0.152: v64.01,27.69 63.97,27.64 U1.3 | U$2.P$9 10.54,44.7 10.54,49.66 v9.4,50.8 7.96,52.24 R3.1
PWM_DRIVER2  (via drill 0.35)
  Route2 0.152: v55.75,29.59 55.5,29.84 55.5,33.91 53.65,35.76 32.56,35.76 24.38,43.94 16.13,43.94 10.92,49.15 v10.92,51.05
  Bottom 0.152: 10.59,52.24 R8.1 10.2,51.74 10.89,51.05 v10.92,51.05 12.06,49.91 U$2.P$19 | U1.16 56.38,28.95 55.75,29.57 v55.75,29.59
PWM_OUT1  (via drill 0.64)
  other vias: 64.39,24.64 64.39,23.37
  pour Bottom (no thermals): 61.72,25.4 64.64,25.4 65.02,25.02 65.02,22.99 64.77,22.73 64.01,22.73 63.75,23.24 63.75,24.51 63.37,24.89 61.72,24.89
  pour Top (no thermals): 59.82,12.7 59.82,16 61.72,17.91 61.85,17.91 63.63,19.68 63.63,24.89 64.14,25.4 64.77,25.4 65.15,25.02 65.15,18.16 62.48,15.49 62.48,12.7
PWM_OUT2
  pour Bottom (no thermals): 56.39,12.57 57.53,12.57 58.42,13.46 58.42,15.49 53.98,19.94 53.98,21.97 55.75,23.75 55.75,24.51 56.13,24.89 57.66,24.89 57.66,25.15 55.63,25.15 53.59,23.11 53.59,22.73 53.21,22.35 52.83,22.35 52.2,21.72 52.2,16.76
SCL  (via drill 0.35)
  Route15 0.152: BACKPLANE_CONN.5 44.56,22.48 33.78,22.48 20.4,35.86 20.4,40.46 19.92,40.94 v19.67,40.94
  Bottom 0.152: v19.67,40.94 19.29,40.94 17.14,43.08 U$2.P$7
SDA  (via drill 0.35)
  Route15 0.152: v19.67,40.01 19.67,35.7 33.53,21.84 36.82,21.84 BACKPLANE_CONN.7
  Bottom 0.152: v19.67,40.01 18.4,41.27 16.64,41.27 16.18,41.73 16.18,47.3 U$2.P$17
TORPEDO1
  pour Bottom (no thermals): 10.16,25.02 10.16,24.26 12.19,22.23 26.42,22.23 27.43,21.21 27.56,21.08 27.56,17.78 26.54,16.76 24.64,16.76 23.5,15.62 23.5,12.06 24.26,11.3 26.54,11.3 29.46,11.3 31.75,13.59 32.38,14.22 32.38,23.88 26.92,29.34 18.29,29.34 16.64,30.99 10.16,30.99
TORPEDO1_GATE  (via drill 0.35)
  Route2 0.152: v1.4,48.39 5.46,52.45 35.18,52.45 v36.32,51.31
  Bottom 0.152: v1.4,48.39 1.4,48.01 3.25,46.16 Q2.1 | U$2.P$2 31.37,44.7 31.37,49.91 31.88,50.42 35.5,50.42 36.32,51.24 v36.32,51.31 37.25,52.24 R18.1
TORPEDO2
  pour Bottom (no thermals): 7.62,30.99 7.62,20.45 11.43,16.64 13.21,16.64 14.86,14.99 14.86,13.34 14.86,12.57 13.59,11.3 4.95,11.3 2.29,13.97 2.29,30.99
TORPEDO2_GATE  (via drill 0.35)
  Route2 0.152: v1.4,43.05 1.09,43.36 1.09,46.7 6.2,51.82 29.21,51.82 v30.73,50.29
  Bottom 0.152: v1.4,43.05 1.68,42.77 1.68,42.75 3.65,40.78 3.72,40.78 Q3.1 | U$2.P$12 30.73,49.15 v30.73,50.29 31.62,51.18 33.55,51.18 R19.1
V+
  pour Top (no thermals): 72.39,27.56 72.39,29.84 72.52,29.97 85.34,29.97 86.74,28.57 86.74,18.54 85.72,17.53 82.68,17.53 81.92,18.29 81.92,20.32 80.39,21.84 78.11,21.84 76.2,23.75 76.2,24.89 74.3,26.8 73.15,26.8
  pour Top (no thermals): 72.39,29.21 72.39,30.1 71.63,30.86 69.72,32.77 67.82,32.77 67.31,33.27 67.31,33.78 67.31,34.04 67.82,34.54 73.91,34.54 78.61,29.84 77.98,29.21
V_DIV  (via drill 0.35)
  Top 0.152: R10.2 R11.1 42.76,51.85 v42.04,52.58
  Route15 0.152: v15.75,49.28 19.05,52.58 v42.04,52.58
  Bottom 0.152: 14.61,43.31 U$2.P$8 15.75,44.32 v15.75,49.28
VPROPI  (via drill 0.35)
  Route2 0.152: v56.9,29.63 56.06,30.46 56.06,34.16 53.9,36.32 32.72,36.32 31.7,37.34 | 31.7,37.34 | 31.7,37.34 23.32,45.72 v19.68,45.72
  Bottom 0.152: U1.15 57.89,28.3 58.17,28.57 58.17,29.08 57.62,29.63 v56.9,29.63 | v19.68,45.72 18.92,46.48 18.92,49.19 17.69,50.42 15.24,50.42 14.61,49.78 U$2.P$18

### Text on the board
tNames: 2 | 1 | 4 | 3 | Torpedo Coils | COIL_2 | COIL_1 | COIL_4 | COIL_3 | AGND | SDA | SCL | PWM_OUT2 | +12V | DROP_2 | +V | AGND | +24V | TORP_2 | TORP_1 | +5V | EXTRA5 | +3V3 | EXTRA6 | PWM_OUT1 | +12V | DROP_1 | +12V | AGND | +24V | AGND | AGND | ACTUATOR BOARD
bNames: All 10K | All 10K | SDA | AGND | PWM / DRV2 | VPROPI | MOTOR / EN | COIL3 / GATE | COIL1 / GATE | DROP2 / GATE | TORP2 / GATE | SCL | AGND | PWM / DRV1 | VDIV | ARM / TORP | COIL4 / GATE | COIL2 / GATE | DROP1 / GATE | TORP1 / GATE | Claw